# EAGLE schematic 1400-1a (EAGLE 6.0)
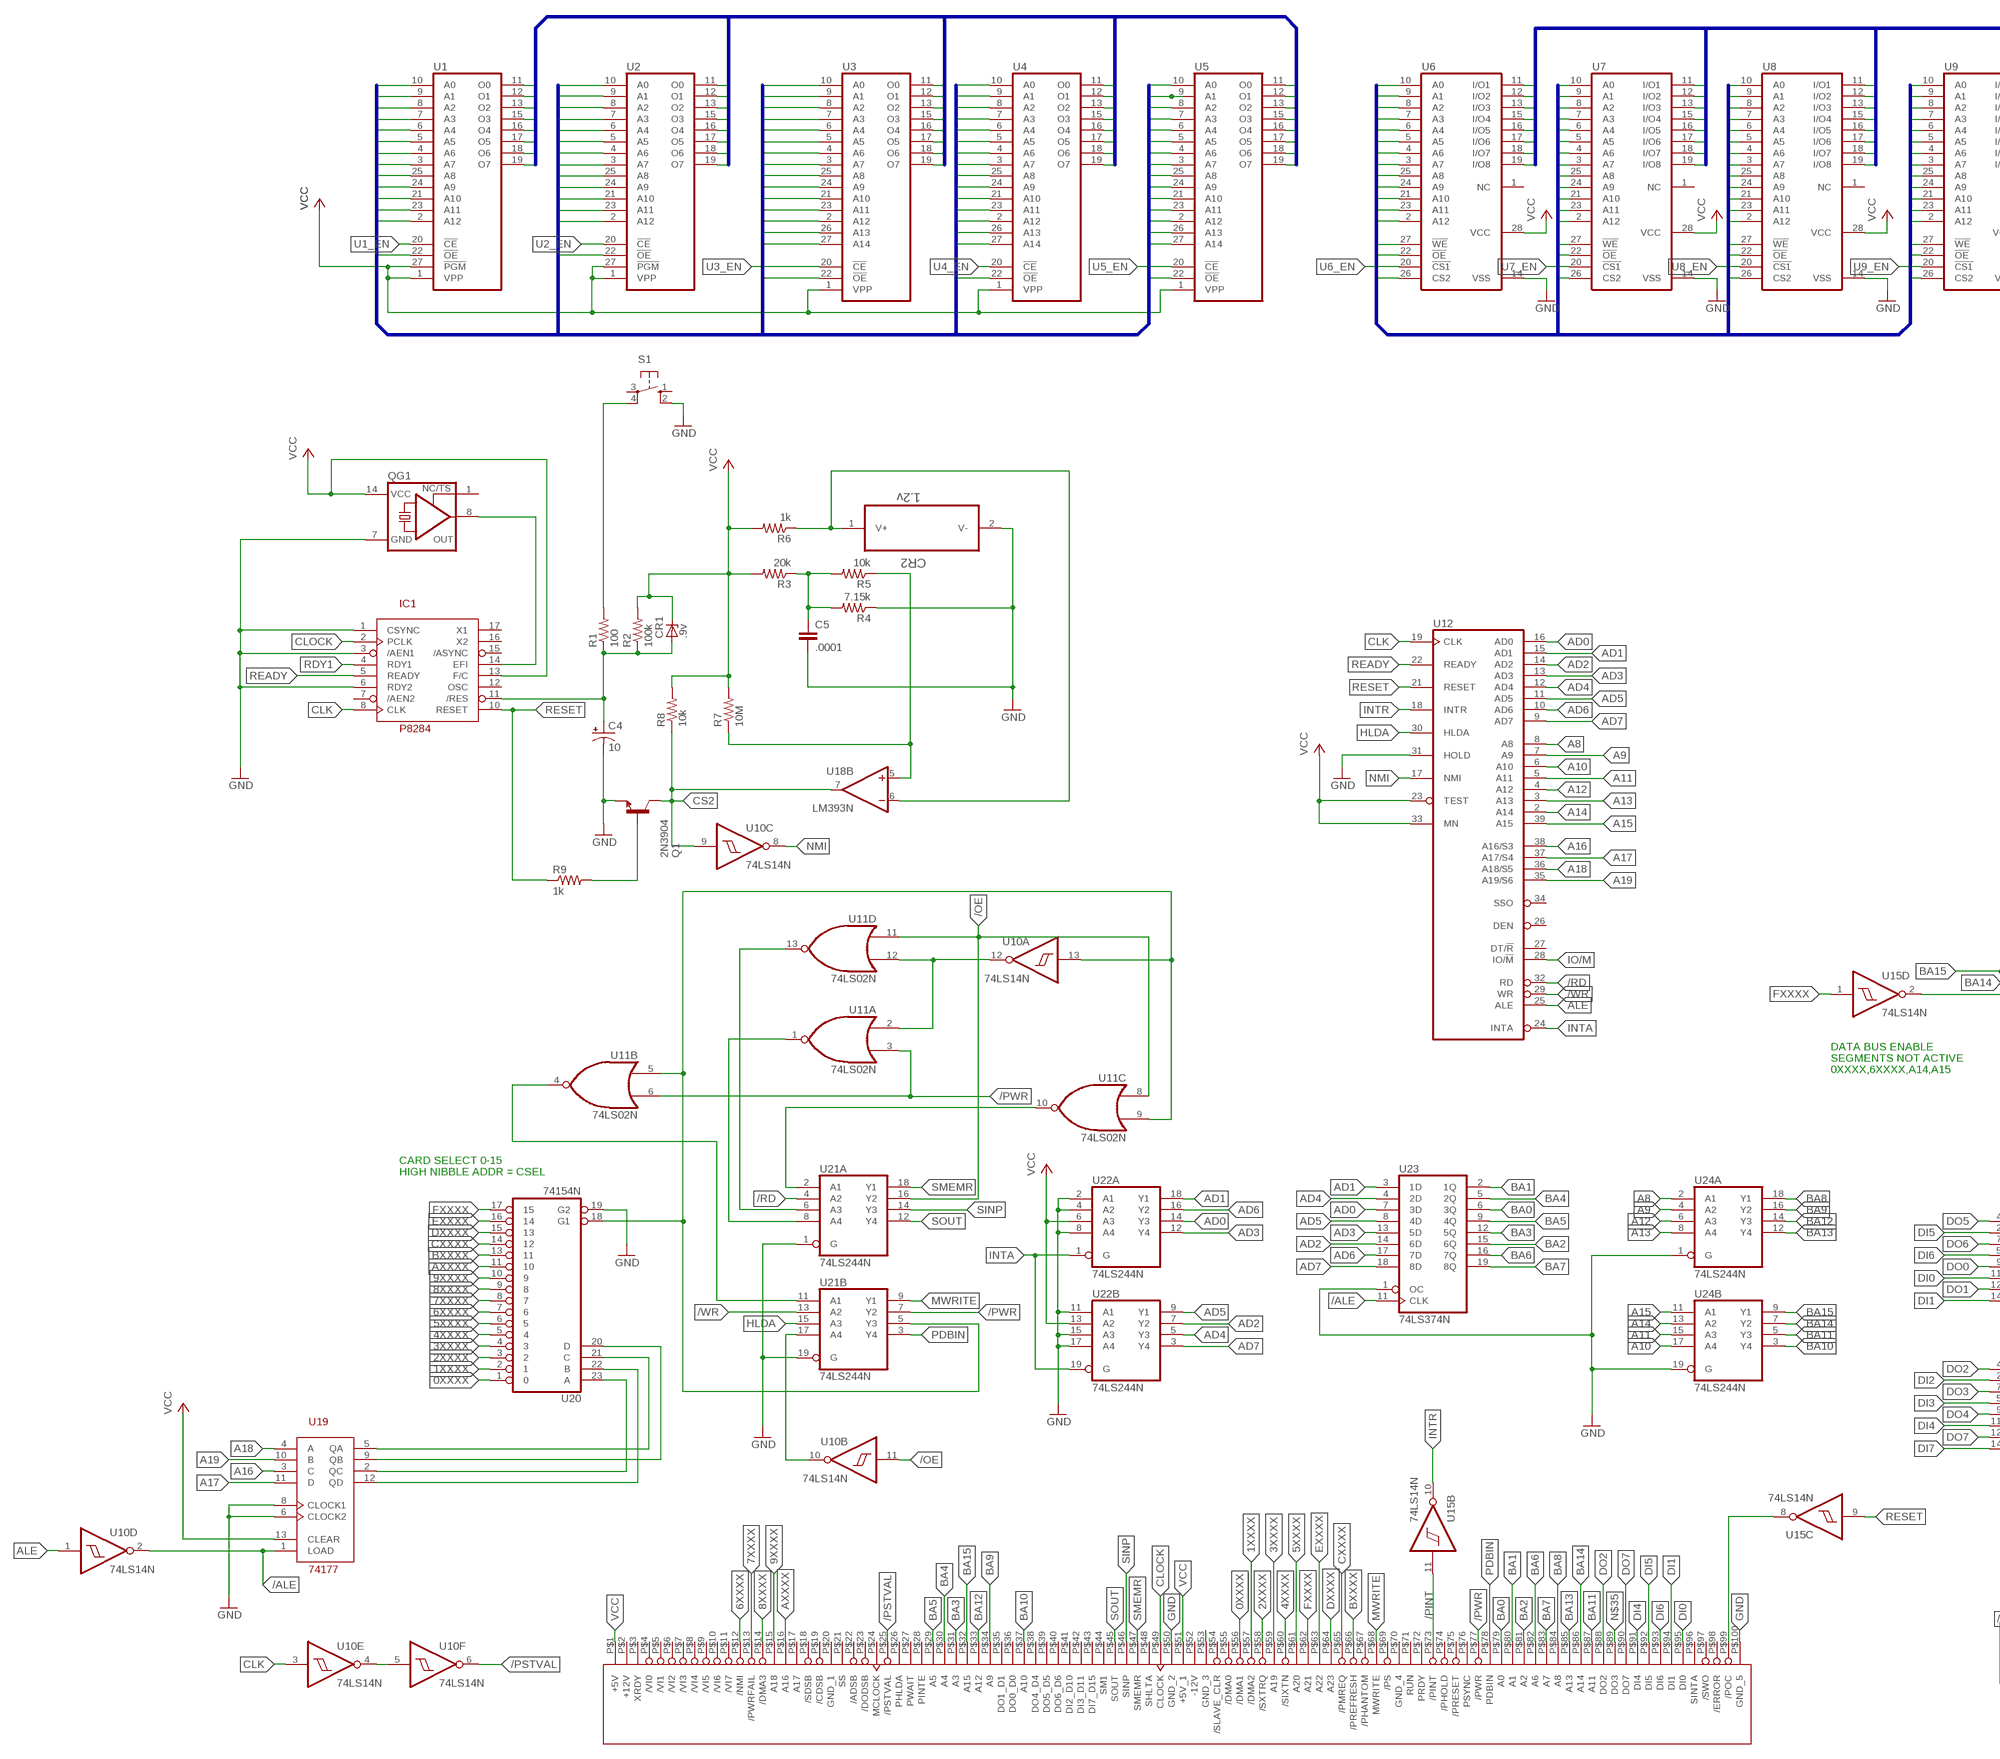
[diagram p0: schematic, sheet 1, part 1 of 2]
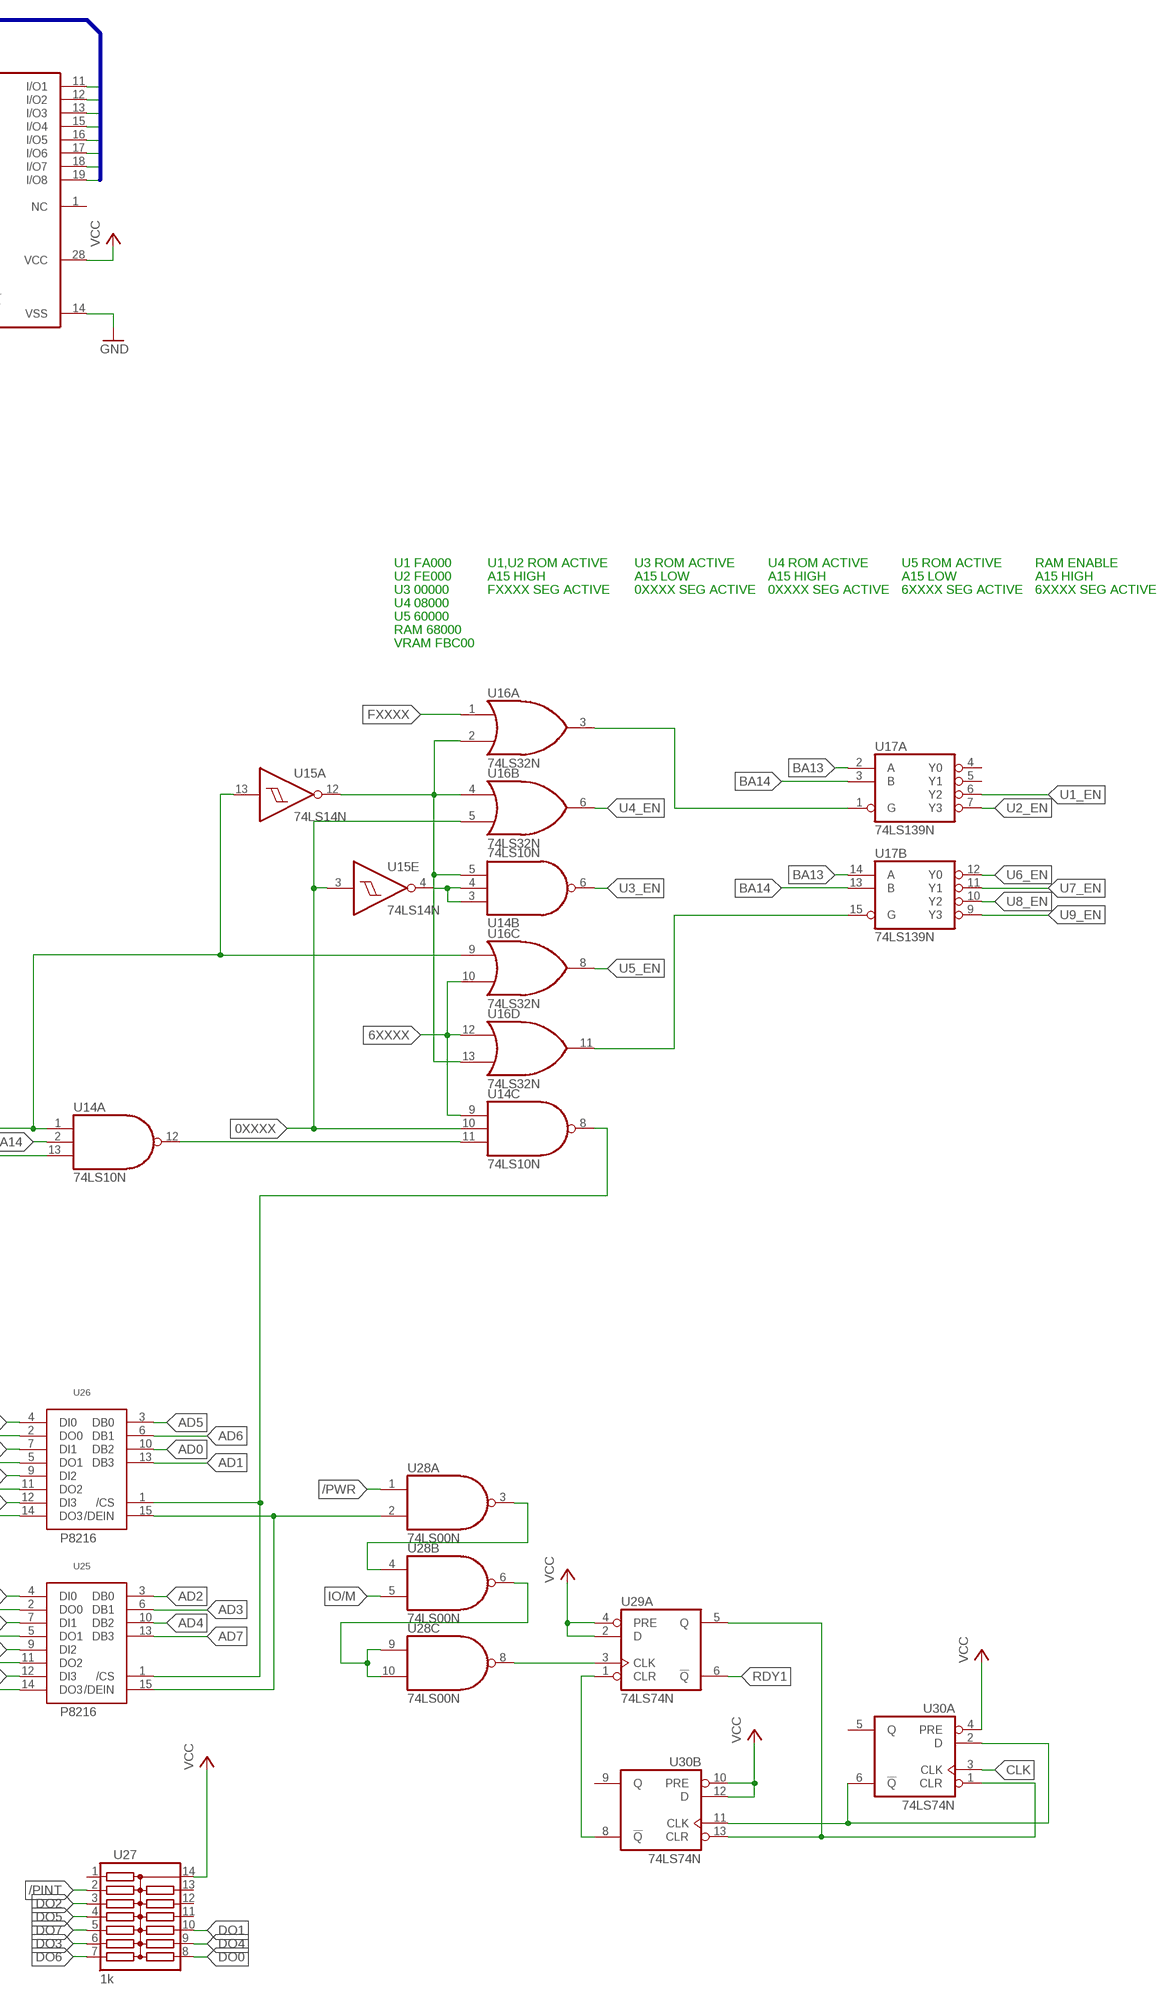
[diagram p1: schematic, sheet 1, part 2 of 2]

## Parts
C4  10  CPOL-USE5-6  [E5-6]
C5  .0001  C-EU050-030X075  [C050-030X075]
CR1  .9v  ZTK  [DO35Z10]
CR2  1.2v  AD589TH  [TO127P557X381-2P]
IC1  P8284  [DIL18]
Q1  2N3904  [TO92]
QG1  XO-14  [DIL14S]
R1  100  R-US_0207/12  [0207/12]
R2  100k  R-US_0207/12  [0207/12]
R3  20k  R-US_0207/12  [0207/12]
R4  7.15k  R-US_0207/12  [0207/12]
R5  10k  R-US_0207/12  [0207/12]
R6  1k  R-US_0207/12  [0207/12]
R7  10M  R-US_0207/12  [0207/12]
R8  10k  R-US_0207/12  [0207/12]
R9  1k  R-US_0207/12  [0207/12]
S1  10-XX  [B3F-10XX]
U1  2764  [DIL28]
U2  2764  [DIL28]
U3  27256  [DIL28]
U4  27256  [DIL28]
U5  27256  [DIL28]
U6  6264A  [DIL28-6]
U7  6264A  [DIL28-6]
U8  6264A  [DIL28-6]
U9  6264A  [DIL28-6]
U10  74LS14N  [DIL14]
U11  74LS02N  [DIL14]
U12  8088MIN  [DIL40]
U14  74LS10N  [DIL14]
U15  74LS14N  [DIL14]
U16  74LS32N  [DIL14]
U17  74LS139N  [DIL16]
U18  LM393N  [DIL08]
U19  74177  [DIL14]
U20  74154N  [DIL24-6]
U21  74LS244N  [DIL20]
U22  74LS244N  [DIL20]
U23  74LS374N  [DIL20]
U24  74LS244N  [DIL20]
U25  P8216  [DIL16]
U26  P8216  [DIL16]
U27  1k  13R  [DIL14]
U28  74LS00N  [DIL14]
U29  74LS74N  [DIL14]
U30  74LS74N  [DIL14]
U$1  S100_MALE  [S100_MALE]

## Nets
0XXXX: U14.10(C:I1) U15.3(E:I) U16.5(B:I1) U20.1 U$1.P$56(/DMA1)
1XXXX: U20.2 U$1.P$57(/DMA2)
2XXXX: U20.3 U$1.P$58(/SXTRQ)
3XXXX: U20.4 U$1.P$59(A19)
4XXXX: U20.5 U$1.P$60(/SIXTN)
5XXXX: U20.6 U$1.P$61(A20)
6XXXX: U14.9(C:I0) U16.10(C:I1) U16.12(D:I0) U20.7 U$1.P$12(/NMI)
7XXXX: U20.8 U$1.P$13(/PWRFAIL)
8XXXX: U20.9 U$1.P$14(/DMA3)
9XXXX: U20.10 U$1.P$15(A18)
/ALE: U10.2(D:O) U19.1(LOAD) U23.11(CLK)
/BCS: U14.8(C:O) U25.1(/CS) U26.1(/CS)
/DEIN: U25.15(/DEIN) U26.15(/DEIN) U28.2(A:I1)
/OE: U1.22(!OE) U2.22(!OE) U3.22(!OE) U4.22(!OE) U5.22(!OE) U6.22(!OE) U7.22(!OE) U8.22(!OE) U9.22(!OE) U10.11(B:I) U11.8(C:I0) U11.11(D:I0) U21.16(A:Y2)
/PINT: U15.11(B:I) U27.2 U$1.P$73(/PINT)
/PSTVAL: U10.6(F:O) U$1.P$25(/PSTVAL)
/PWR: U6.27(!WE) U7.27(!WE) U8.27(!WE) U9.27(!WE) U11.3(A:I1) U11.6(B:I1) U21.7(B:Y2) U28.1(A:I0) U$1.P$77(/PWR)
/RD: U12.32(RD) U21.4(A:A2)
/WR: U12.29(WR) U21.13(B:A2)
A8: U12.8(A8) U24.2(A:A1)
A9: U12.7(A9) U24.4(A:A2)
A10: U12.6(A10) U24.17(B:A4)
A11: U12.5(A11) U24.15(B:A3)
A12: U12.4(A12) U24.6(A:A3)
A13: U12.3(A13) U24.8(A:A4)
A14: U12.2(A14) U24.13(B:A2)
A15: U12.39(A15) U24.11(B:A1)
A16: U12.38(A16/S3) U19.3(C)
A17: U12.37(A17/S4) U19.11(D)
A18: U12.36(A18/S5) U19.4(A)
A19: U12.35(A19/S6) U19.10(B)
AD0: U1.11(O0) U2.11(O0) U3.11(O0) U4.11(O0) U5.11(O0) U12.16(AD0) U22.14(A:Y3) U23.7(3D) U26.10(DB2)
AD1: U1.12(O1) U2.12(O1) U3.12(O1) U4.12(O1) U5.12(O1) U12.15(AD1) U22.18(A:Y1) U23.3(1D) U26.13(DB3)
AD2: U1.13(O2) U2.13(O2) U3.13(O2) U4.13(O2) U5.13(O2) U12.14(AD2) U22.7(B:Y2) U23.14(6D) U25.3(DB0)
AD3: U1.15(O3) U2.15(O3) U3.15(O3) U4.15(O3) U5.15(O3) U12.13(AD3) U22.12(A:Y4) U23.13(5D) U25.6(DB1)
AD4: U1.16(O4) U2.16(O4) U3.16(O4) U4.16(O4) U5.16(O4) U12.12(AD4) U22.5(B:Y3) U23.4(2D) U25.10(DB2)
AD5: U1.17(O5) U2.17(O5) U3.17(O5) U4.17(O5) U5.17(O5) U12.11(AD5) U22.9(B:Y1) U23.8(4D) U26.3(DB0)
AD6: U1.18(O6) U2.18(O6) U3.18(O6) U4.18(O6) U5.18(O6) U12.10(AD6) U22.16(A:Y2) U23.17(7D) U26.6(DB1)
AD7: U1.19(O7) U2.19(O7) U3.19(O7) U4.19(O7) U5.19(O7) U12.9(AD7) U22.3(B:Y4) U23.18(8D) U25.13(DB3)
ALE: U10.1(D:I) U12.25(ALE)
AXXXX: U20.11 U$1.P$16(A16)
BA0: U1.10(A0) U2.10(A0) U3.10(A0) U4.10(A0) U5.10(A0) U6.10(A0) U7.10(A0) U8.10(A0) U9.10(A0) U23.6(3Q) U$1.P$79(A0)
BA1: U1.9(A1) U2.9(A1) U3.7(A3) U3.9(A1) U4.9(A1) U5.9(A1) U6.9(A1) U7.9(A1) U8.9(A1) U9.9(A1) U23.2(1Q) U$1.P$80(A1)
BA2: U1.8(A2) U2.8(A2) U3.8(A2) U4.8(A2) U5.8(A2) U6.8(A2) U7.8(A2) U8.8(A2) U9.8(A2) U23.15(6Q) U$1.P$81(A2)
BA3: U1.7(A3) U2.7(A3) U4.7(A3) U5.7(A3) U6.7(A3) U7.7(A3) U8.7(A3) U9.7(A3) U23.12(5Q) U$1.P$31(A3)
BA4: U1.6(A4) U2.6(A4) U3.6(A4) U4.6(A4) U5.6(A4) U6.6(A4) U7.6(A4) U8.6(A4) U9.6(A4) U23.5(2Q) U$1.P$30(A4)
BA5: U1.5(A5) U2.5(A5) U3.5(A5) U4.5(A5) U5.5(A5) U6.5(A5) U7.5(A5) U8.5(A5) U9.5(A5) U23.9(4Q) U$1.P$29(A5)
BA6: U1.4(A6) U2.4(A6) U3.4(A6) U4.4(A6) U5.4(A6) U6.4(A6) U7.4(A6) U8.4(A6) U9.4(A6) U23.16(7Q) U$1.P$82(A6)
BA7: U1.3(A7) U2.3(A7) U3.3(A7) U4.3(A7) U5.3(A7) U6.3(A7) U7.3(A7) U8.3(A7) U9.3(A7) U23.19(8Q) U$1.P$83(A7)
BA8: U1.25(A8) U2.25(A8) U3.25(A8) U4.25(A8) U5.25(A8) U6.25(A8) U7.25(A8) U8.25(A8) U9.25(A8) U24.18(A:Y1) U$1.P$84(A8)
BA9: U1.24(A9) U2.24(A9) U3.24(A9) U4.24(A9) U5.24(A9) U6.24(A9) U7.24(A9) U8.24(A9) U9.24(A9) U24.16(A:Y2) U$1.P$34(A9)
BA10: U1.21(A10) U2.21(A10) U3.21(A10) U4.21(A10) U5.21(A10) U6.21(A10) U7.21(A10) U8.21(A10) U9.21(A10) U24.3(B:Y4) U$1.P$37(A10)
BA11: U1.23(A11) U2.23(A11) U3.23(A11) U4.23(A11) U5.23(A11) U6.23(A11) U7.23(A11) U8.23(A11) U9.23(A11) U24.5(B:Y3) U$1.P$87(A11)
BA12: U1.2(A12) U2.2(A12) U3.2(A12) U4.2(A12) U5.2(A12) U6.2(A12) U7.2(A12) U8.2(A12) U9.2(A12) U24.14(A:Y3) U$1.P$33(A12)
BA13: U3.26(A13) U4.26(A13) U5.26(A13) U17.2(A:A) U17.14(B:A) U24.12(A:Y4) U$1.P$85(A13)
BA14: U3.27(A14) U4.27(A14) U5.27(A14) U14.2(A:I1) U17.3(A:B) U17.13(B:B) U24.7(B:Y2) U$1.P$86(A14)
BA15: U14.1(A:I0) U15.13(A:I) U16.9(C:I0) U24.9(B:Y1) U$1.P$32(A15)
BXXXX: U20.13 U$1.P$66(/PREFRESH)
CLK: IC1.8(CLK) U10.3(E:I) U12.19(CLK) U30.3(A:CLK)
CLOCK: IC1.2(PCLK) U$1.P$49(CLOCK)
CS2: Q1.1(C) R8.1 U6.26(CS2) U7.26(CS2) U8.26(CS2) U9.26(CS2) U10.9(C:I) U18.7(B:OUT)
CXXXX: U20.14 U$1.P$65(/PMREQ)
D0: U6.11(I/O1) U7.11(I/O1) U8.11(I/O1) U9.11(I/O1)
D1: U6.12(I/O2) U7.12(I/O2) U8.12(I/O2) U9.12(I/O2)
D2: U6.13(I/O3) U7.13(I/O3) U8.13(I/O3) U9.13(I/O3)
D3: U6.15(I/O4) U7.15(I/O4) U8.15(I/O4) U9.15(I/O4)
D4: U6.16(I/O5) U7.16(I/O5) U8.16(I/O5) U9.16(I/O5)
D5: U6.17(I/O6) U7.17(I/O6) U8.17(I/O6) U9.17(I/O6)
D6: U6.18(I/O7) U7.18(I/O7) U8.18(I/O7) U9.18(I/O7)
D7: U6.19(I/O8) U7.19(I/O8) U8.19(I/O8) U9.19(I/O8)
DI0: U26.11(DO2) U$1.P$95(DI0)
DI1: U26.14(DO3) U$1.P$94(DI1)
DI2: U25.2(DO0)
DI3: U25.5(DO1)
DI4: U25.11(DO2) U$1.P$91(DI4)
DI5: U26.2(DO0) U$1.P$92(DI5)
DI6: U26.5(DO1) U$1.P$93(DI6)
DI7: U25.14(DO3)
DO0: U26.9(DI2) U27.8
DO1: U26.12(DI3) U27.10
DO2: U25.4(DI0) U27.3 U$1.P$88(DO2)
DO3: U25.7(DI1) U27.6
DO4: U25.9(DI2) U27.9
DO5: U26.4(DI0) U27.4
DO6: U26.7(DI1) U27.7
DO7: U25.12(DI3) U27.5 U$1.P$90(DO7)
DXXXX: U20.15 U$1.P$64(A23)
EXXXX: U20.16 U$1.P$63(A22)
FXXXX: U15.1(D:I) U16.1(A:I0) U20.17 U$1.P$62(A21)
GND: C4.- C5.2 CR2.2(V-) IC1.1(CSYNC) IC1.3(/AEN1) IC1.6(RDY2) Q1.3(E) QG1.7(GND) R4.1 S1.2(S1) U6.14(VSS) U7.14(VSS) U8.14(VSS) U9.14(VSS) U12.31(HOLD) U19.6(CLOCK2) U19.8(CLOCK1) U20.19(G2) U21.1(A:G) U21.19(B:G) U22.2(A:A1) U22.4(A:A2) U22.8(A:A4) U22.11(B:A1) U22.15(B:A3) U22.17(B:A4) U23.1(OC) U24.1(A:G) U24.19(B:G) U$1.P$50(GND_2) U$1.P$100(GND_5)
HLDA: U12.30(HLDA) U21.15(B:A3)
INTA: U12.24(INTA) U22.1(A:G) U22.19(B:G)
INTR: U12.18(INTR) U15.10(B:O)
IO/M: U12.28(IO/!M) U28.5(B:I1)
MWRITE: U21.9(B:Y1) U$1.P$68(MWRITE)
N$1: U10.10(B:O) U21.17(B:A4)
N$2: U19.9(QB) U20.20(D)
N$3: U14.11(C:I2) U14.12(A:O)
N$4: U14.3(B:I0) U14.4(B:I1) U15.4(E:O)
N$5: U28.3(A:O) U28.4(B:I0)
N$6: U$1.P$53(GND_3)
N$7: U28.6(B:O) U28.9(C:I0) U28.10(C:I1)
N$8: U10.4(E:O) U10.5(F:I)
N$10: U11.1(A:O) U21.8(A:A4)
N$11: U11.13(D:O) U21.6(A:A3)
N$12: U10.13(A:I) U11.5(B:I0) U11.9(C:I1) U20.18(G1) U21.5(B:Y3)
N$13: U11.10(C:O) U21.2(A:A1)
N$14: U11.4(B:O) U21.11(B:A1)
N$15: U10.12(A:O) U11.2(A:I0) U11.12(D:I1)
N$16: U19.5(QA) U20.21(C)
N$17: U19.12(QD) U20.22(B)
N$18: U19.2(QC) U20.23(A)
N$19: C4.+ CR1.A IC1.11(/RES) R1.1 R2.1
N$20: C5.1 R3.1 R4.2 R5.2
N$21: R1.2 S1.4(P1)
N$22: IC1.14(EFI) QG1.8(OUT)
N$23: Q1.2(B) R9.2
N$24: R5.1 R7.1 U18.5(B:+IN)
N$25: U28.8(C:O) U29.3(A:CLK)
N$26: U29.5(A:Q) U30.1(A:CLR) U30.13(B:CLR)
N$27: U16.3(A:O) U17.1(A:G)
N$28: U30.2(A:D) U30.6(A:!Q) U30.11(B:CLK)
N$29: U29.1(A:CLR) U30.8(B:!Q)
N$30: U14.5(B:I2) U15.12(A:O) U16.2(A:I1) U16.4(B:I0) U16.13(D:I1)
N$31: U15.8(C:O) U$1.P$99(/POC)
N$32: U16.11(D:O) U17.15(B:G)
N$33: CR2.1(V+) R6.1 U18.6(B:-IN)
N$34: U14.13(A:I2) U15.2(D:O)
N$35: U$1.P$89(DO3)
NMI: U10.8(C:O) U12.17(NMI)
PDBIN: U21.3(B:Y4) U$1.P$78(PDBIN)
RDY1: IC1.4(RDY1) U29.6(A:!Q)
READY: IC1.5(READY) U12.22(READY)
RESET: IC1.10(RESET) R9.1 U12.21(RESET) U15.9(C:I)
SINP: U21.14(A:Y3) U$1.P$46(SINP)
SMEMR: U21.18(A:Y1) U$1.P$47(SMEMR)
SOUT: U21.12(A:Y4) U$1.P$45(SOUT)
U1_EN: U1.20(!CE) U17.6(A:Y2)
U2_EN: U2.20(!CE) U17.7(A:Y3)
U3_EN: U3.20(!CE) U14.6(B:O)
U4_EN: U4.20(!CE) U16.6(B:O)
U5_EN: U5.20(!CE) U16.8(C:O)
U6_EN: U6.20(!CS1) U17.12(B:Y0)
U7_EN: U7.20(!CS1) U17.11(B:Y1)
U8_EN: U8.20(!CS1) U17.10(B:Y2)
U9_EN: U9.20(!CS1) U17.9(B:Y3)
VCC: CR1.C IC1.13(F/C) QG1.14(VCC) R2.2 R3.2 R6.2 R7.2 R8.2 U1.1(VPP) U1.27(!PGM) U2.1(VPP) U2.27(!PGM) U3.1(VPP) U4.1(VPP) U5.1(VPP) U6.28(VCC) U7.28(VCC) U8.28(VCC) U9.28(VCC) U12.23(TEST) U12.33(MN) U19.13(CLEAR) U22.6(A:A3) U22.13(B:A2) U27.14 U29.2(A:D) U29.4(A:PRE) U30.4(A:PRE) U30.10(B:PRE) U30.12(B:D) U$1.P$1(+5V) U$1.P$51(+5V_1)
Unconnected: IC1.7(/AEN2) IC1.12(OSC) IC1.15(/ASYNC) IC1.16(X2) IC1.17(X1) QG1.1(TS) S1.1(S) S1.3(P) U6.1(NC) U7.1(NC) U8.1(NC) U9.1(NC) U12.26(DEN) U12.27(DT/!R) U12.34(SSO) U15.5(F:I) U15.6(F:O) U17.4(A:Y0) U17.5(A:Y1) U18.1(A:OUT) U18.2(A:-IN) U18.3(A:+IN) U27.1 U27.11 U27.12 U27.13 U28.11(D:O) U28.12(D:I0) U28.13(D:I1) U29.8(B:!Q) U29.9(B:Q) U29.10(B:PRE) U29.11(B:CLK) U29.12(B:D) U29.13(B:CLR) U30.5(A:Q) U30.9(B:Q) U$1.P$3(XRDY) U$1.P$4(/VI0) U$1.P$5(/VI1) U$1.P$6(/VI2) U$1.P$7(/VI3) U$1.P$8(/VI4) U$1.P$9(/VI5) U$1.P$10(/VI6) U$1.P$11(/VI7) U$1.P$17(A17) U$1.P$18(/SDSB) U$1.P$19(/CDSB) U$1.P$21(SS) U$1.P$22(/ADSB) U$1.P$23(/DODSB) U$1.P$24(MCLOCK) U$1.P$26(PHLDA) U$1.P$27(PWAIT) U$1.P$28(PINTE) U$1.P$35(DO1_D1) U$1.P$36(DO0_D0) U$1.P$38(DO4_D4) U$1.P$39(DO5_D5) U$1.P$40(DO6_D6) U$1.P$41(DI2_D10) U$1.P$42(DI3_D11) U$1.P$43(DI7_D15) U$1.P$44(SM1) U$1.P$48(SHLTA) U$1.P$54(/SLAVE_CLR) U$1.P$55(/DMA0) U$1.P$67(/PHANTOM) U$1.P$69(/PS) U$1.P$71(RUN) U$1.P$72(PRDY) U$1.P$74(/PHOLD) U$1.P$75(/PRESET) U$1.P$76(PSYNC) U$1.P$96(SINTA) U$1.P$97(/SWO) U$1.P$98(/ERROR)

## Buses
D[0..7]
BA[0..12],/PWR,/OE,CS2
AD[0..7]
BA[0..14],/OE

## Notes on the sheet
- U1 FA000 | U1,U2 ROM ACTIVE | U3 ROM ACTIVE | U4 ROM ACTIVE | U5 ROM ACTIVE | RAM ENABLE
- U2 FE000 | A15 HIGH | A15 LOW | A15 HIGH | A15 LOW | A15 HIGH
- U3 00000 | FXXXX SEG ACTIVE | 0XXXX SEG ACTIVE | 0XXXX SEG ACTIVE | 6XXXX SEG ACTIVE | 6XXXX SEG ACTIVE
- U4 08000
- U5 60000
- RAM 68000
- VRAM FBC00
- DATA BUS ENABLE
- SEGMENTS NOT ACTIVE
- 0XXXX,6XXXX,A14,A15
- CARD SELECT 0-15
- HIGH NIBBLE ADDR = CSEL

## Power pins joined to a net without a drawn wire
+12V: U$1.P$2(+12V)
-12V: U$1.P$52(-12V)
GND: IC1.9(GND) U1.14(GND) U2.14(GND) U3.14(GND) U4.14(GND) U5.14(GND) U10.7(P:GND) U11.7(P:GND) U12.1(GND) U12.20(GND) U14.7(P:GND) U15.7(P:GND) U16.7(P:GND) U17.8(P:GND) U19.7(GND) U20.12(GND) U21.10(P:GND) U22.10(P:GND) U23.10(GND) U24.10(P:GND) U25.8(GND) U26.8(GND) U28.7(P:GND) U29.7(P:GND) U30.7(P:GND)
GND_1: U$1.P$20(GND_1)
GND_4: U$1.P$70(GND_4)
V+: U18.8(P:V+)
V-: U18.4(P:V-)
VCC: IC1.18(VCC) U1.28(VCC) U2.28(VCC) U3.28(VCC) U4.28(VCC) U5.28(VCC) U10.14(P:VCC) U11.14(P:VCC) U12.40(VCC) U14.14(P:VCC) U15.14(P:VCC) U16.14(P:VCC) U17.16(P:VCC) U19.14(VCC) U20.24(VCC) U21.20(P:VCC) U22.20(P:VCC) U23.20(VCC) U24.20(P:VCC) U25.16(VCC) U26.16(VCC) U28.14(P:VCC) U29.14(P:VCC) U30.14(P:VCC)

## Library data of the parts
C4 = resistor:CPOL-US: POLARIZED CAPACITOR, American symbol
C5 = resistor:C-EU: CAPACITOR, European symbol
CR1 = diode:ZTK: Z DIODE
CR2 = ADI-Phase-2:AD589TH: Two-Terminal IC 1.2 V Reference; MPN: AD589TH; OC_FARNELL: 1423788; OC_NEWARK: 66F6736; PACKAGE: TO-51-2; SUPPLIER: Analog Devices
IC1 = s100:P8284
Q1 = transistor-npn:2N3904: NPN Transistor
QG1 = crystal:XO-: CRYSTAL; OC_FARNELL: unknown; OC_NEWARK: unknown
R1-R9 = resistor:R-US_: RESISTOR, American symbol
S1 = switch-omron:10-XX: OMRON SWITCH; MPN: B3F-1000; OC_FARNELL: 176432; OC_NEWARK: 36M3542
U1 U2 = memory:2764: MEMORY
U3-U5 = memory:27256: MEMORY
U6-U9 = memory-hitachi:6264A: MEMORY; OC_FARNELL: 283605; OC_NEWARK: unknown
U10 U15 = 74xx-us:74*14: Hex schmitt trigger INVERTER
U11 = 74xx-us:74*02: Quad 2-input NOR gate
U12 = micro-intel:8088MIN: MICROCOMPUTER/PERIPHERAL DEVICE; OC_FARNELL: unknown; OC_NEWARK: unknown
U14 = 74xx-us:74*10: Triple 3-input NAND gate
U16 = 74xx-us:74*32: Quad 2-input OR gate
U17 = 74xx-us:74*139: Dual 2-line to 4-line DECODER/DEMULTIPLEXER
U18 = linear:LM393: COMPARATOR
U19 = s100:74177
U20 = 74xx-us:74*154: 4-line to 16-line data SELECTOR/MULTIPLEXER
U21 U22 U24 = 74xx-us:74*244: Octal BUFFER and LINE DRIVER, 3-state
U23 = 74xx-us:74*374: Octal D type transparent LATCH, edge triggered
U25 U26 = s100:P8216
U27 = resistor-dil:13R: DIL RESISTOR; OC_FARNELL: unknown; OC_NEWARK: unknown
U28 = 74xx-us:74*00: Quad 2-input NAND gate
U29 U30 = 74xx-us:74*74: Dual D type positive edge triggered FLIP FLOP, preset and clear
U$1 = s100:S100_MALE